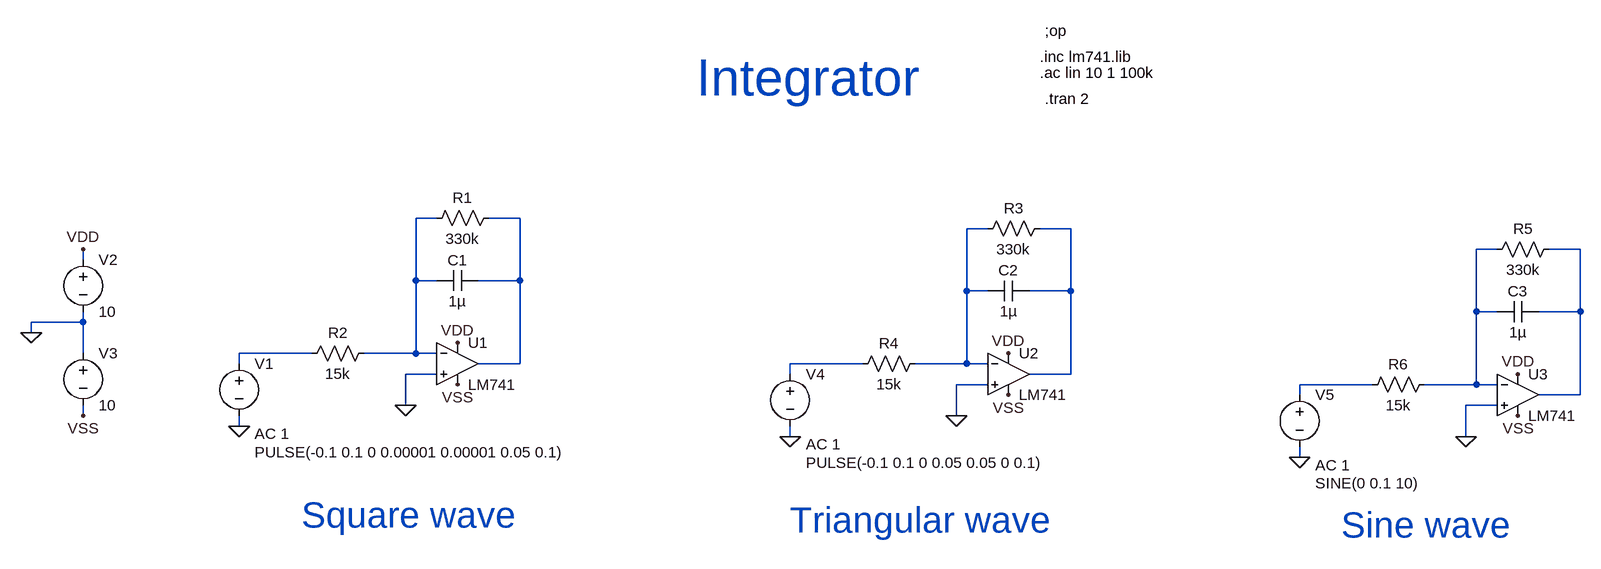
[diagram p0: schematic integrator.asc]
integrator.asc, the LTspice schematic file:
Version 4
SHEET 1 1784 680
WIRE -368 -96 -400 -96
WIRE -240 -96 -288 -96
WIRE 480 -80 448 -80
WIRE 608 -80 560 -80
WIRE 1264 -48 1232 -48
WIRE 1392 -48 1344 -48
WIRE -912 -32 -912 -48
WIRE -400 0 -400 -96
WIRE -368 0 -400 0
WIRE -240 0 -240 -96
WIRE -240 0 -304 0
WIRE 448 16 448 -80
WIRE 480 16 448 16
WIRE 608 16 608 -80
WIRE 608 16 544 16
WIRE 1232 48 1232 -48
WIRE 1264 48 1232 48
WIRE 1392 48 1392 -48
WIRE 1392 48 1328 48
WIRE -912 64 -912 48
WIRE -912 64 -992 64
WIRE -992 80 -992 64
WIRE -912 112 -912 64
WIRE -560 112 -672 112
WIRE -400 112 -400 0
WIRE -400 112 -480 112
WIRE -368 112 -400 112
WIRE -672 128 -672 112
WIRE -240 128 -240 0
WIRE -240 128 -304 128
WIRE 288 128 176 128
WIRE 448 128 448 16
WIRE 448 128 368 128
WIRE 480 128 448 128
WIRE -368 144 -416 144
WIRE 176 144 176 128
WIRE 608 144 608 16
WIRE 608 144 544 144
WIRE 480 160 432 160
WIRE 1072 160 960 160
WIRE 1232 160 1232 48
WIRE 1232 160 1152 160
WIRE 1264 160 1232 160
WIRE 960 176 960 160
WIRE 1392 176 1392 48
WIRE 1392 176 1328 176
WIRE -416 192 -416 144
WIRE 1264 192 1216 192
WIRE -912 208 -912 192
WIRE 432 208 432 160
WIRE -672 224 -672 208
WIRE 176 240 176 224
WIRE 1216 240 1216 192
WIRE 960 272 960 256
FLAG -416 192 0
FLAG -992 80 0
FLAG -672 224 0
FLAG -912 -48 VDD
FLAG -336 96 VDD
FLAG -912 208 VSS
FLAG -336 160 VSS
FLAG 432 208 0
FLAG 176 240 0
FLAG 512 112 VDD
FLAG 512 176 VSS
FLAG 1216 240 0
FLAG 960 272 0
FLAG 1296 144 VDD
FLAG 1296 208 VSS
SYMBOL OpAmps\\opamp2 -336 64 R0
SYMATTR InstName U1
SYMATTR Value LM741
SYMBOL voltage -672 112 R0
WINDOW 3 24 152 Left 2
WINDOW 123 24 124 Left 2
WINDOW 39 0 0 Left 0
SYMATTR Value PULSE(-0.1 0.1 0 0.00001 0.00001 0.05 0.1)
SYMATTR Value2 AC 1
SYMATTR InstName V1
SYMBOL voltage -912 -48 R0
WINDOW 123 0 0 Left 0
WINDOW 39 0 0 Left 0
SYMATTR InstName V2
SYMATTR Value 10
SYMBOL voltage -912 96 R0
WINDOW 123 0 0 Left 0
WINDOW 39 0 0 Left 0
SYMATTR InstName V3
SYMATTR Value 10
SYMBOL res -272 -112 R90
WINDOW 0 0 56 VBottom 2
WINDOW 3 32 56 VTop 2
SYMATTR InstName R1
SYMATTR Value 330k
SYMBOL res -464 96 R90
WINDOW 0 0 56 VBottom 2
WINDOW 3 32 56 VTop 2
SYMATTR InstName R2
SYMATTR Value 15k
SYMBOL cap -304 -16 R90
WINDOW 0 0 32 VBottom 2
WINDOW 3 32 32 VTop 2
SYMATTR InstName C1
SYMATTR Value 1µ
SYMBOL OpAmps\\opamp2 512 80 R0
SYMATTR InstName U2
SYMATTR Value LM741
SYMBOL voltage 176 128 R0
WINDOW 3 24 152 Left 2
WINDOW 123 24 124 Left 2
WINDOW 39 0 0 Left 0
SYMATTR Value PULSE(-0.1 0.1 0 0.05 0.05 0 0.1)
SYMATTR Value2 AC 1
SYMATTR InstName V4
SYMBOL res 576 -96 R90
WINDOW 0 0 56 VBottom 2
WINDOW 3 32 56 VTop 2
SYMATTR InstName R3
SYMATTR Value 330k
SYMBOL res 384 112 R90
WINDOW 0 0 56 VBottom 2
WINDOW 3 32 56 VTop 2
SYMATTR InstName R4
SYMATTR Value 15k
SYMBOL cap 544 0 R90
WINDOW 0 0 32 VBottom 2
WINDOW 3 32 32 VTop 2
SYMATTR InstName C2
SYMATTR Value 1µ
SYMBOL OpAmps\\opamp2 1296 112 R0
SYMATTR InstName U3
SYMATTR Value LM741
SYMBOL voltage 960 160 R0
WINDOW 3 24 152 Left 2
WINDOW 123 24 124 Left 2
WINDOW 39 0 0 Left 0
SYMATTR Value SINE(0 0.1 10)
SYMATTR Value2 AC 1
SYMATTR InstName V5
SYMBOL res 1360 -64 R90
WINDOW 0 0 56 VBottom 2
WINDOW 3 32 56 VTop 2
SYMATTR InstName R5
SYMATTR Value 330k
SYMBOL res 1168 144 R90
WINDOW 0 0 56 VBottom 2
WINDOW 3 32 56 VTop 2
SYMATTR InstName R6
SYMATTR Value 15k
SYMBOL cap 1328 32 R90
WINDOW 0 0 32 VBottom 2
WINDOW 3 32 32 VTop 2
SYMATTR InstName C3
SYMATTR Value 1µ
TEXT 560 -344 Left 2 !.inc lm741.lib
TEXT 568 -384 Left 2 !;op
TEXT 560 -320 Left 2 !.ac lin 10 1 100k
TEXT 568 -280 Left 2 !.tran 2
TEXT -576 360 Left 5 ;Square wave
TEXT 176 368 Left 5 ;Triangular wave
TEXT 1024 376 Left 5 ;Sine wave
TEXT 32 -312 Left 6 ;Integrator

The netlist it stands for:
* integrator.asc
XU1 0 N001 VDD VSS N002 LM741  ; pins In+ In- V+ V- OUT
V1 N007 0 PULSE(-0.1 0.1 0 0.00001 0.00001 0.05 0.1) AC 1
V2 VDD 0 10
V3 0 VSS 10
R1 N002 N001 330k
R2 N001 N007 15k
C1 N002 N001 1µ
XU2 0 N003 VDD VSS N004 LM741  ; pins In+ In- V+ V- OUT
V4 N008 0 PULSE(-0.1 0.1 0 0.05 0.05 0 0.1) AC 1
R3 N004 N003 330k
R4 N003 N008 15k
C2 N004 N003 1µ
XU3 0 N005 VDD VSS N006 LM741  ; pins In+ In- V+ V- OUT
V5 N009 0 SINE(0 0.1 10) AC 1
R5 N006 N005 330k
R6 N005 N009 15k
C3 N006 N005 1µ
.inc lm741.lib
;op
.ac lin 10 1 100k
.tran 2
* Square wave
* Triangular wave
* Sine wave
* Integrator
.backanno
.end